# EAGLE schematic Over_current_Over_voltage_Decoupling (EAGLE 7.2.0)
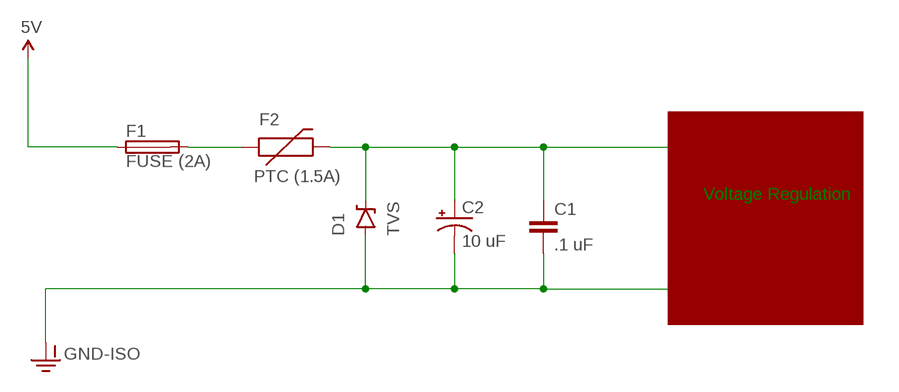
[diagram p0: schematic, sheet 1]

## Parts
C1  .1 uF  CAP1206  [1206]
C2  10 uF  CAP_POLPTH2  [CPOL-RADIAL-10UF-25V]
D1  TVS  DIODE-ZENERPTH  [DIODE-ZENER]
F1  FUSE (2A)  FUSE1821  [FUSE_HOLDER_MENTOR-1821]
F2  PTC (1.5A)  PTCPTH  [PTC]

## Nets
5V: F1.A
GND-ISO: C1.2 C2.2(-) D1.P$2(A)
N$1: F1.B F2.P$1
N$2: C1.1 C2.1(+) D1.P$1(C) F2.P$2

## Notes on the sheet
- Voltage Regulation

## Library data of the parts
C1 = SparkFun-Capacitors:CAP: Capacitor Standard 0603 ceramic capacitor, and 0.1" leaded capacitor.
C2 = SparkFun-Passives:CAP_POL: Capacitor Polarized These are standard SMD and PTH capacitors. Normally 10uF, 47uF, and 100uF in electrolytic and tantalum varieties. Always verify the external diameter of the through hole cap, it varies with capacity, voltage, and manufacturer. The EIA devices should be standard.
D1 = SparkFun-DiscreteSemi:DIODE-ZENER: Zener Diode Production Part - 8199 3.4V Zener Voltage
F1 = fuse:FUSE: Fuse; OC_FARNELL: unknown; OC_NEWARK: unknown
F2 = SparkFun-PowerIC:PTC: Resettable Fuse PTC Resettable Fuse. Spark Fun Electronics SKU : COM-08357